# EAGLE design shield (EAGLE 7.1.0)
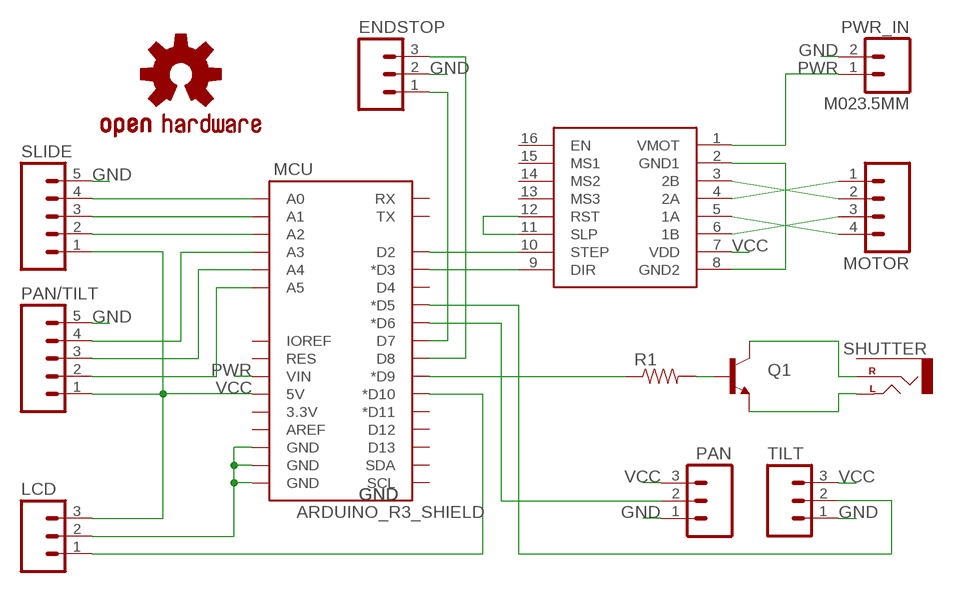
[diagram p0: schematic, sheet 1]

## Parts
ENDSTOP  M03PTH  [1X03]
LCD  M03PTH  [1X03]
LOGO1  OSHW-LOGOM  [OSHW-LOGO-M]
MCU  ARDUINO_R3_SHIELD  [UNO_R3_SHIELD]
MOTOR  M04POLAR  [MOLEX-1X4]
PAN  M03PTH  [1X03]
PAN/TILT  M05PTH  [1X05]
PWR_IN  M023.5MM  [SCREWTERMINAL-3.5MM-2]
Q1  TRANSISTOR_NPN2N3904  [TO-92]
R1  RESISTORAXIAL-0.3  [AXIAL-0.3]
SHUTTER  AUDIO-JACKPTH  [AUDIO-JACK]
SLIDE  M05PTH  [1X05]
SOCKET  POLOLU DRIVER  POLOLUESTEPPERDRIVER  [DIL16]
TILT  M03PTH  [1X03]

## Nets
1A [power]: MOTOR.4 SOCKET.5(1A)
1B [power]: MOTOR.3 SOCKET.6(1B)
2A [power]: MOTOR.1 SOCKET.4(2A)
2B [power]: MOTOR.2 SOCKET.3(2B)
GND: ENDSTOP.2 LCD.2 MCU.GND@0(GND) MCU.GND@1(GND) MCU.GND@2(GND) PAN.1 PAN/TILT.5 PWR_IN.2 SLIDE.5 TILT.1
N$1: MCU.D2 SOCKET.10(STEP)
N$2: MCU.D3(*D3) SOCKET.9(DIR)
N$3: LCD.1 MCU.D10(*D10)
N$8: MCU.A0 SLIDE.4
N$9: MCU.A1 SLIDE.3
N$10: MCU.A2 SLIDE.2
N$11: MCU.D9(*D9) R1.P$1
N$12: Q1.2(B) R1.P$2
N$13: Q1.3(C) SHUTTER.RING(RIGHT)
N$14: Q1.1(E) SHUTTER.TIP(LEFT)
N$15: MCU.D6(*D6) PAN.2
N$16: ENDSTOP.1 MCU.D7
N$17: ENDSTOP.3 MCU.D8
N$18: MCU.D5(*D5) TILT.2
N$19: SOCKET.2(GND1) SOCKET.8(GND2)
N$20: MCU.A3 PAN/TILT.4
N$21: MCU.A4 PAN/TILT.3
N$22: MCU.A5 PAN/TILT.2
N$23: SOCKET.11(SLP) SOCKET.12(RST)
PWR [power]: MCU.VIN PWR_IN.1 SOCKET.1(VMOT)
VCC: LCD.3 MCU.5V PAN.3 PAN/TILT.1 SLIDE.1 SOCKET.7(VDD) TILT.3
Unconnected: MCU.3.3V MCU.AREF MCU.D4 MCU.D11(*D11) MCU.D12 MCU.D13 MCU.IOREF MCU.RES MCU.RX MCU.SCL MCU.SDA MCU.TX SHUTTER.SLEEVE SOCKET.13(MS3) SOCKET.14(MS2) SOCKET.15(MS1) SOCKET.16(EN)

## Library data of the parts
ENDSTOP LCD PAN TILT = SparkFun-Connectors:M03: Header 3 Standard 3-pin 0.1" header. Use with straight break away headers (SKU : PRT-00116), right angle break away headers (PRT-00553), swiss pins (PRT-00743), machine pins (PRT-00117), and female headers (PRT-00115). Molex polarized connector foot print use with SKU : PRT-08232 with associated crimp pins and housings.
LOGO1 = SparkFun-Aesthetics:OSHW-LOGO: Open Source Hardware Logo This logo indicates the piece of hardware it is found on incorporates a OSHW license and/or adheres to the definition of open source hardware found here: http://freedomdefined.org/OSHW
MCU = SparkFun-Boards:ARDUINO_R3_SHIELD: Shield form compatible with the Arduino Uno R3.
MOTOR = SparkFun-Connectors:M04: Header 4 Standard 4-pin 0.1" header. Use with straight break away headers (SKU : PRT-00116), right angle break away headers (PRT-00553), swiss pins (PRT-00743), machine pins (PRT-00117), and female headers (PRT-00115). Molex polarized connector foot print use with SKU : PRT-08231 with associated crimp pins and housings. 1MM SMD Version SKU: PRT-10208
PAN/TILT SLIDE = SparkFun-Connectors:M05: Header 5 Standard 5-pin 0.1" header. Use with straight break away headers (SKU : PRT-00116), right angle break away headers (PRT-00553), swiss pins (PRT-00743), machine pins (PRT-00117), and female headers (PRT-00115). Molex polarized connector foot print use with SKU : PRT-08230 with associated crimp pins and housings.
PWR_IN = SparkFun-Connectors:M02: Standard 2-pin 0.1" header. Use with - straight break away headers ( PRT-00116) - right angle break away headers (PRT-00553) - swiss pins (PRT-00743) - machine pins (PRT-00117) - female headers (PRT-00115) Molex polarized connector foot print use with: PRT-08233 with associated crimp pins and housings. 2.54_SCREWTERM for use with PRT-10571. 3.5mm Screw Terminal footprints for PRT-08084 5mm Screw Terminal footprints for use with PRT-08432
Q1 = SparkFun-DiscreteSemi:TRANSISTOR_NPN: Generic NPN BJT MMBT2222A - TRANS-08049 (SOT-23, 1A 40V) MPSA42 - TRANS-09116 (SOT-23, 500mA 300V) MMBT5088LT1G - TRANS-11160 (SOT-23, 50 mA 30V) BC547 - COM-08928 <http://www.sparkfun.com/products/8928> (TO-92 45V 100mA) (1.Collector 2.Base 3.Emitter) 2N3904 - COM-00521 <http://www.sparkfun.com/products/521> (TO-92 40V 200mA) (1.Emitter 2.Base 3.Collector) P2N2222A - COM-12852 <http://www.sparkfun.com/products/12852> (TO-92 40V 600mA) (1.Collector 2.Base 3.Emitter); PROD_ID: TRANS-08447
R1 = SparkFun-Passives:RESISTOR: Resistor Basic schematic elements and footprints for 0603, 1206, and PTH resistors.
SHUTTER = SparkFun-Connectors:AUDIO-JACK: 3.5mm Audio Jack Simple 3.5mm common PCB mount audio jack. SKU: PRT-08032
SOCKET = reprap:POLOLUESTEPPERDRIVER: Pololu stepper driver based on the A4983.

## Net classes
1 power: width 0.61 mm, clearance 0.305 mm

## Board
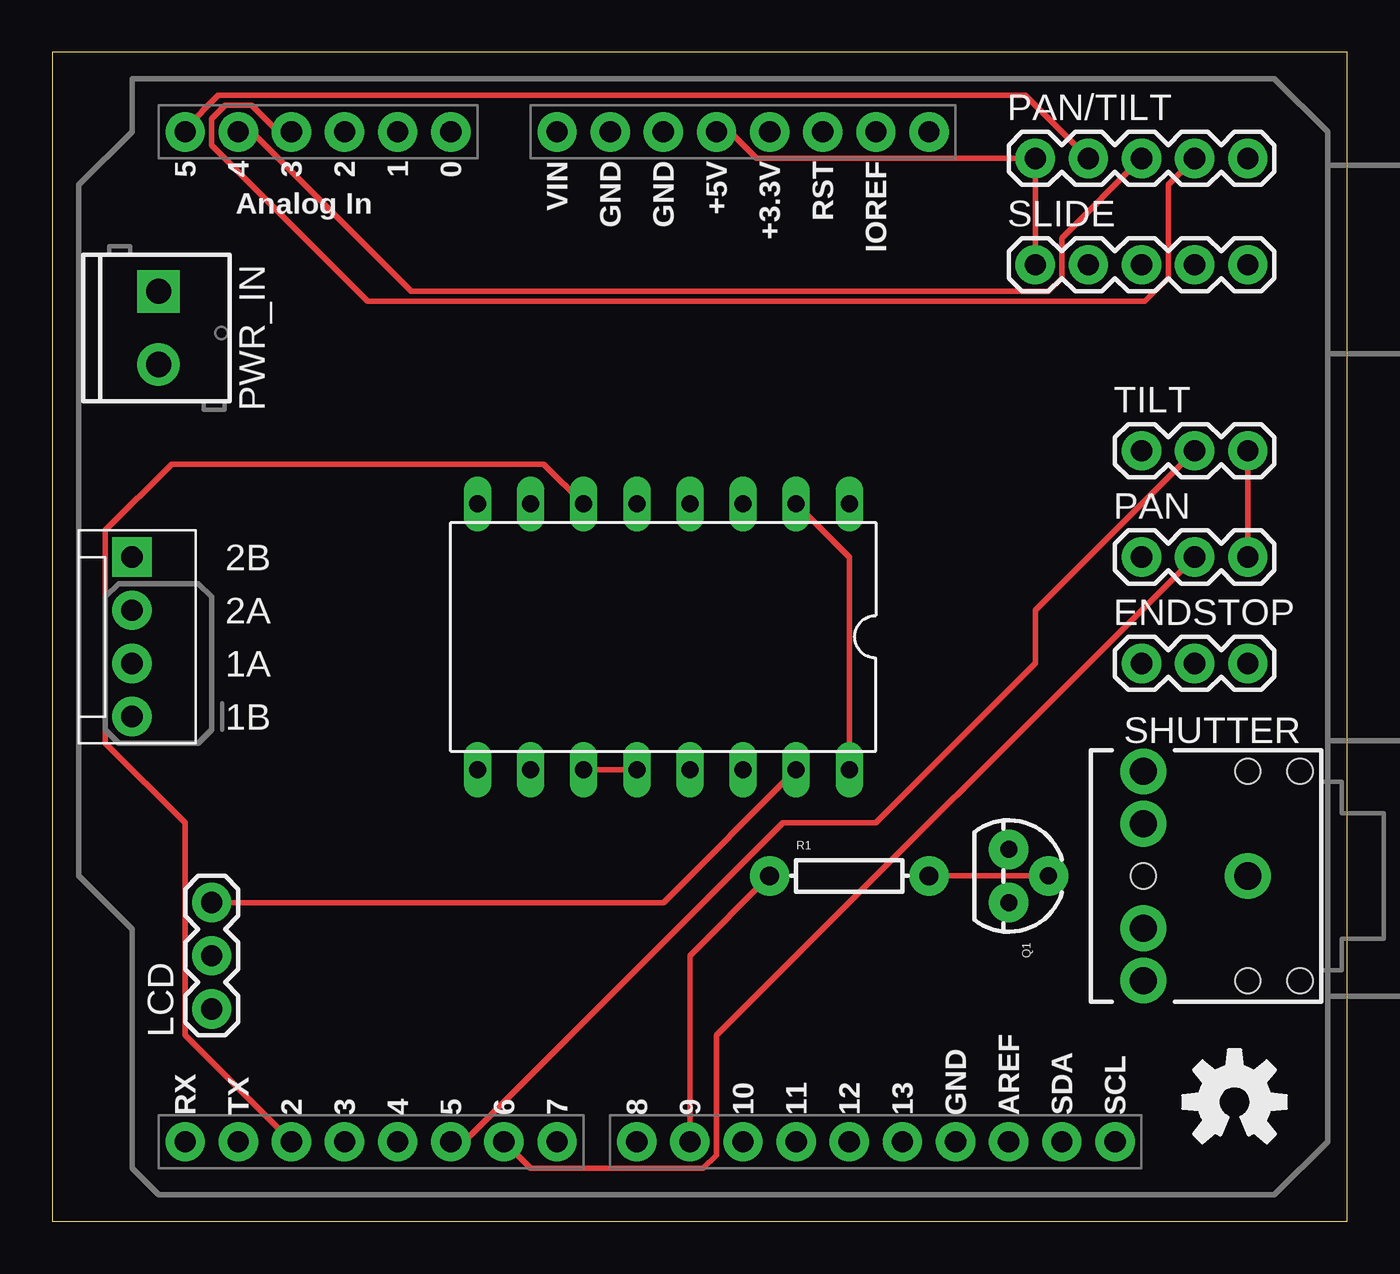
[diagram p1: board, top side]
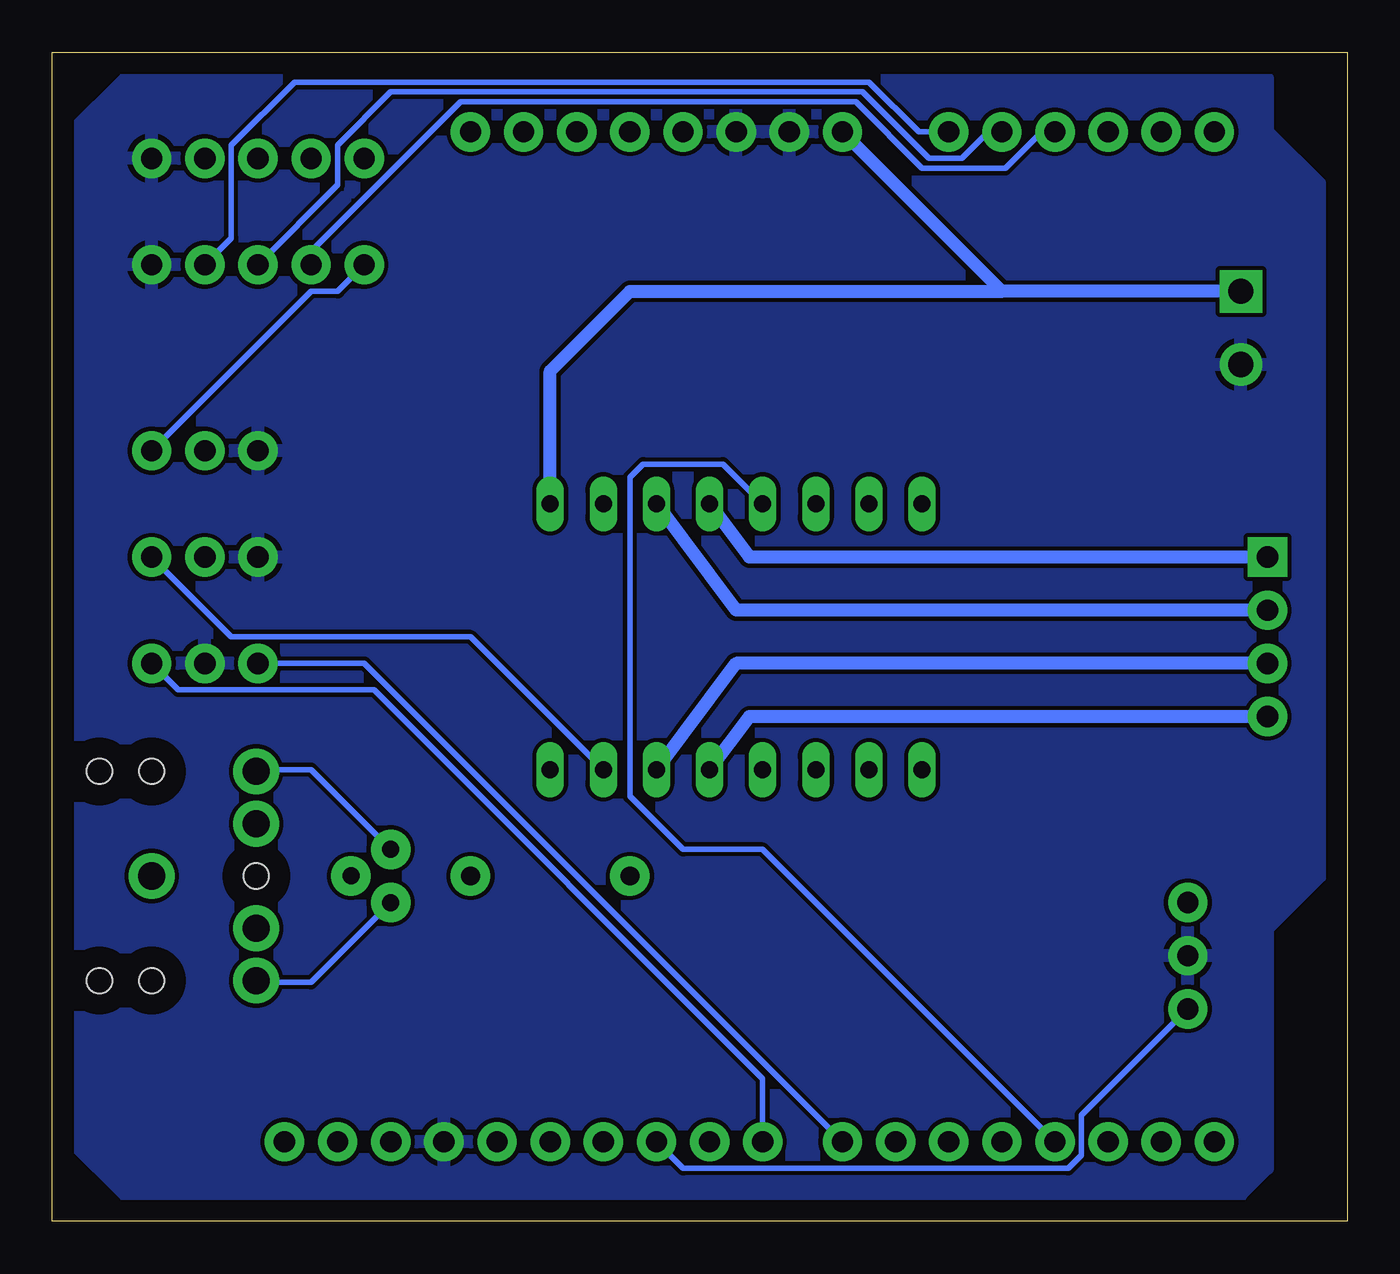
[diagram p2: board, bottom side, seen from below]

Size 61.9 x 55.87 mm. Coordinates in mm from the lower left corner, seen from the top.
Outline: 0,0 61.9,0 61.9,55.87 0,55.87 0,0
Copper layers (1*16): Top 0.035mm / dielectric 1.5mm / Bottom 0.035mm
Design rules "default": minimum track width 10mil, minimum drill 24mil, track to track 8mil, track to pad 8mil, pad to pad 8mil, via to via 8mil, smd to smd 8mil, copper to edge 40mil, drill to drill 8mil, minimum pad ring 10mil, minimum via ring 8mil, stop-mask expansion 4mil, vias tented up to drill 0mil, thermal gap 10mil

### Footprints (pad centres in the part's own frame; a part is rotated, then mirrored left to right if it is on the bottom)
1X03 = drill 1.016 pad 1.88: 1 0,0; 2 2.54,0; 3 5.08,0
UNO_R3_SHIELD = drill 1.016 pad 1.88: 3.3V 50.8,26.67; 5V 50.8,29.21; A0 50.8,41.91; A1 50.8,44.45; A2 50.8,46.99; A3 50.8,49.53; A4 50.8,52.07; A5 50.8,54.61; AREF 2.54,15.24; D2 2.54,49.53; D3 2.54,46.99; D4 2.54,44.45; D5 2.54,41.91; D6 2.54,39.37; D7 2.54,36.83; D8 2.54,33.02; D9 2.54,30.48; D10 2.54,27.94; D11 2.54,25.4; D12 2.54,22.86; D13 2.54,20.32; GND@0 50.8,31.75; GND@1 50.8,34.29; GND@2 2.54,17.78; IOREF 50.8,21.59; NC 50.8,19.05; RES 50.8,24.13; RX 2.54,54.61; SCL 2.54,10.16; SDA 2.54,12.7; TX 2.54,52.07; VIN 50.8,36.83
MOLEX-1X4 = drill 1.016 pad 1.88 square: 1 0,0 | drill 1.016 pad 1.88: 2 2.54,0; 3 5.08,0; 4 7.62,0
1X05 = drill 1.016 pad 1.88: 1 0,0; 2 2.54,0; 3 5.08,0; 4 7.62,0; 5 10.16,0
SCREWTERMINAL-3.5MM-2 = drill 1.2 pad 2.032 square: 1 0,0 | drill 1.2 pad 2.032: 2 3.5,0
TO-92 = drill 0.813 pad 1.88: 1 -1.27,0; 2 0,1.905; 3 1.27,0
AXIAL-0.3 = drill 0.9 pad 1.88: P$1 -3.81,0; P$2 3.81,0
AUDIO-JACK = drill 1.3 pad 2.184: RING 5,5; RSH 5,2.5; SLEEVE 0,0; TIP 5,-5; TSH 5,-2.5 | hole 1.2: 0,5; -2.5,5; -2.5,-5; 0,-5; 5,0
DIL16 = drill 0.813 long: 1 -17.78,8.89; 2 -17.78,6.35; 3 -17.78,3.81; 4 -17.78,1.27; 5 -5.08,1.27; 6 -5.08,3.81; 7 -5.08,6.35; 8 -5.08,8.89; 9 -17.78,-1.27; 10 -17.78,-3.81; 11 -5.08,-3.81; 12 -5.08,-1.27; 13 -17.78,-6.35; 14 -17.78,-8.89; 15 -5.08,-6.35; 16 -5.08,-8.89

### Placement (x,y rotation side)
ENDSTOP  52.07,26.67 0 top
LCD  7.62,10.16 90 top
LOGO1  56.51,5.71 0 top
MCU  60.96,1.27 90 top
MOTOR  3.81,31.75 270 top
PAN  52.07,31.75 0 top
PAN/TILT  46.99,50.8 0 top
PWR_IN  5.08,44.45 270 top
Q1  45.72,16.51 270 top
R1  38.1,16.51 0 top
SHUTTER  57.15,16.51 180 top
SLIDE  46.99,45.72 0 top
SOCKET  29.21,16.51 270 top
TILT  52.07,36.83 0 top

### Tracks (layer width: path | path; a pad name or v marks a point on that pad's centre or on a via)
1A
  Bottom 0.61: MOTOR.4 28.57,24.13 SOCKET.5
1B
  Bottom 0.61: MOTOR.3 29.21,26.67 SOCKET.6
2A
  Bottom 0.61: MOTOR.1 28.57,31.75 SOCKET.4
2B
  Bottom 0.61: MOTOR.2 29.21,29.21 SOCKET.3
GND
  Bottom 0.254: 26.83,52.07 MCU.GND@1 27.3,52.07 | MCU.GND@0
  pour Bottom: 3.81,54.61 3.81,52.07 1.27,49.53 1.27,16.51 3.81,13.97 3.81,2.54 5.08,1.27 58.42,1.27 60.96,3.81 60.96,52.07 58.42,54.61
N$1
  Top 0.254: MCU.D2 6.35,8.89 6.35,19.05 2.54,22.86 2.54,33.02 5.71,36.2 23.5,36.2 SOCKET.10
N$2
  Bottom 0.254: SOCKET.9 29.84,36.2 33.65,36.2 34.29,35.56 34.29,20.32 31.75,17.78 27.94,17.78 MCU.D3
N$3
  Bottom 0.254: LCD.1 12.7,5.08 12.7,3.18 13.34,2.54 31.75,2.54 MCU.D10
N$8
  Bottom 0.254: MCU.A0 20.48,52.07 22.86,54.45 50.32,54.45 53.34,51.44 53.34,46.99 SLIDE.4
N$9
  Bottom 0.254: MCU.A1 17.14,52.07 18.41,50.8 20,50.8 23.18,53.97 45.72,53.97 48.26,51.44 48.26,49.53 SLIDE.3
N$10
  Bottom 0.254: MCU.A2 14.61,52.07 16.35,50.32 20.32,50.32 23.5,53.5 42.39,53.5 49.53,46.36 SLIDE.2
N$11
  Top 0.254: MCU.D9 30.48,12.7 R1.P$1
N$12
  Top 0.254: Q1.2 R1.P$2
N$13
  Bottom 0.254: Q1.3 49.53,11.43 52.07,11.43 SHUTTER.RING
N$14
  Bottom 0.254: Q1.1 49.53,21.59 52.07,21.59 SHUTTER.TIP
N$15
  Top 0.254: MCU.D6 22.86,2.54 31.11,2.54 31.75,3.18 31.75,8.89 PAN.2
N$16
  Bottom 0.254: MCU.D7 46.99,26.67 ENDSTOP.1
N$17
  Bottom 0.254: MCU.D8 27.94,6.83 46.51,25.4 55.88,25.4 ENDSTOP.3
N$18
  Top 0.254: MCU.D5 19.68,3.81 34.92,19.05 39.37,19.05 46.99,26.67 46.99,29.21 TILT.2
N$19
  Top 0.254: SOCKET.8 38.1,31.75 SOCKET.2
N$20
  Top 0.254: MCU.A3 10.79,52.07 9.53,53.34 8.26,53.34 7.62,52.7 7.62,51.44 15.08,43.97 52.23,43.97 53.34,45.08 53.34,49.53 PAN/TILT.4
N$21
  Top 0.254: MCU.A4 9.53,52.07 17.14,44.45 47.62,44.45 48.26,45.08 48.26,46.99 PAN/TILT.3
N$22
  Top 0.254: PAN/TILT.2 46.51,53.82 7.94,53.82 6.35,52.23 MCU.A5
N$23
  Top 0.254: SOCKET.12 SOCKET.11
PWR
  Bottom 0.61: PWR_IN.1 16.51,44.45 | 16.51,44.45 MCU.VIN | SOCKET.1 38.1,40.64 34.29,44.45 16.51,44.45
VCC
  Top 0.254: SLIDE.1 PAN/TILT.1 33.65,50.8 32.38,52.07 MCU.5V | LCD.3 29.21,15.24 SOCKET.7 | PAN.3 TILT.3
  Bottom 0.254: TILT.3 49.53,44.45 48.26,44.45 SLIDE.1 | PAN.3 53.34,27.94 41.91,27.94 SOCKET.7

### Text on the board
tNames: 2B | 2A | 1A | 1B